# Altium schematic sheet 09_Misc.SchDoc: Misc
size A3; Organization: Lime Microsystems; Address1: Surrey Tech Centre; Address2: Guildford GU2 7YG; Address3: Surrey; Address4: United Kingdom; SheetNumber: 9
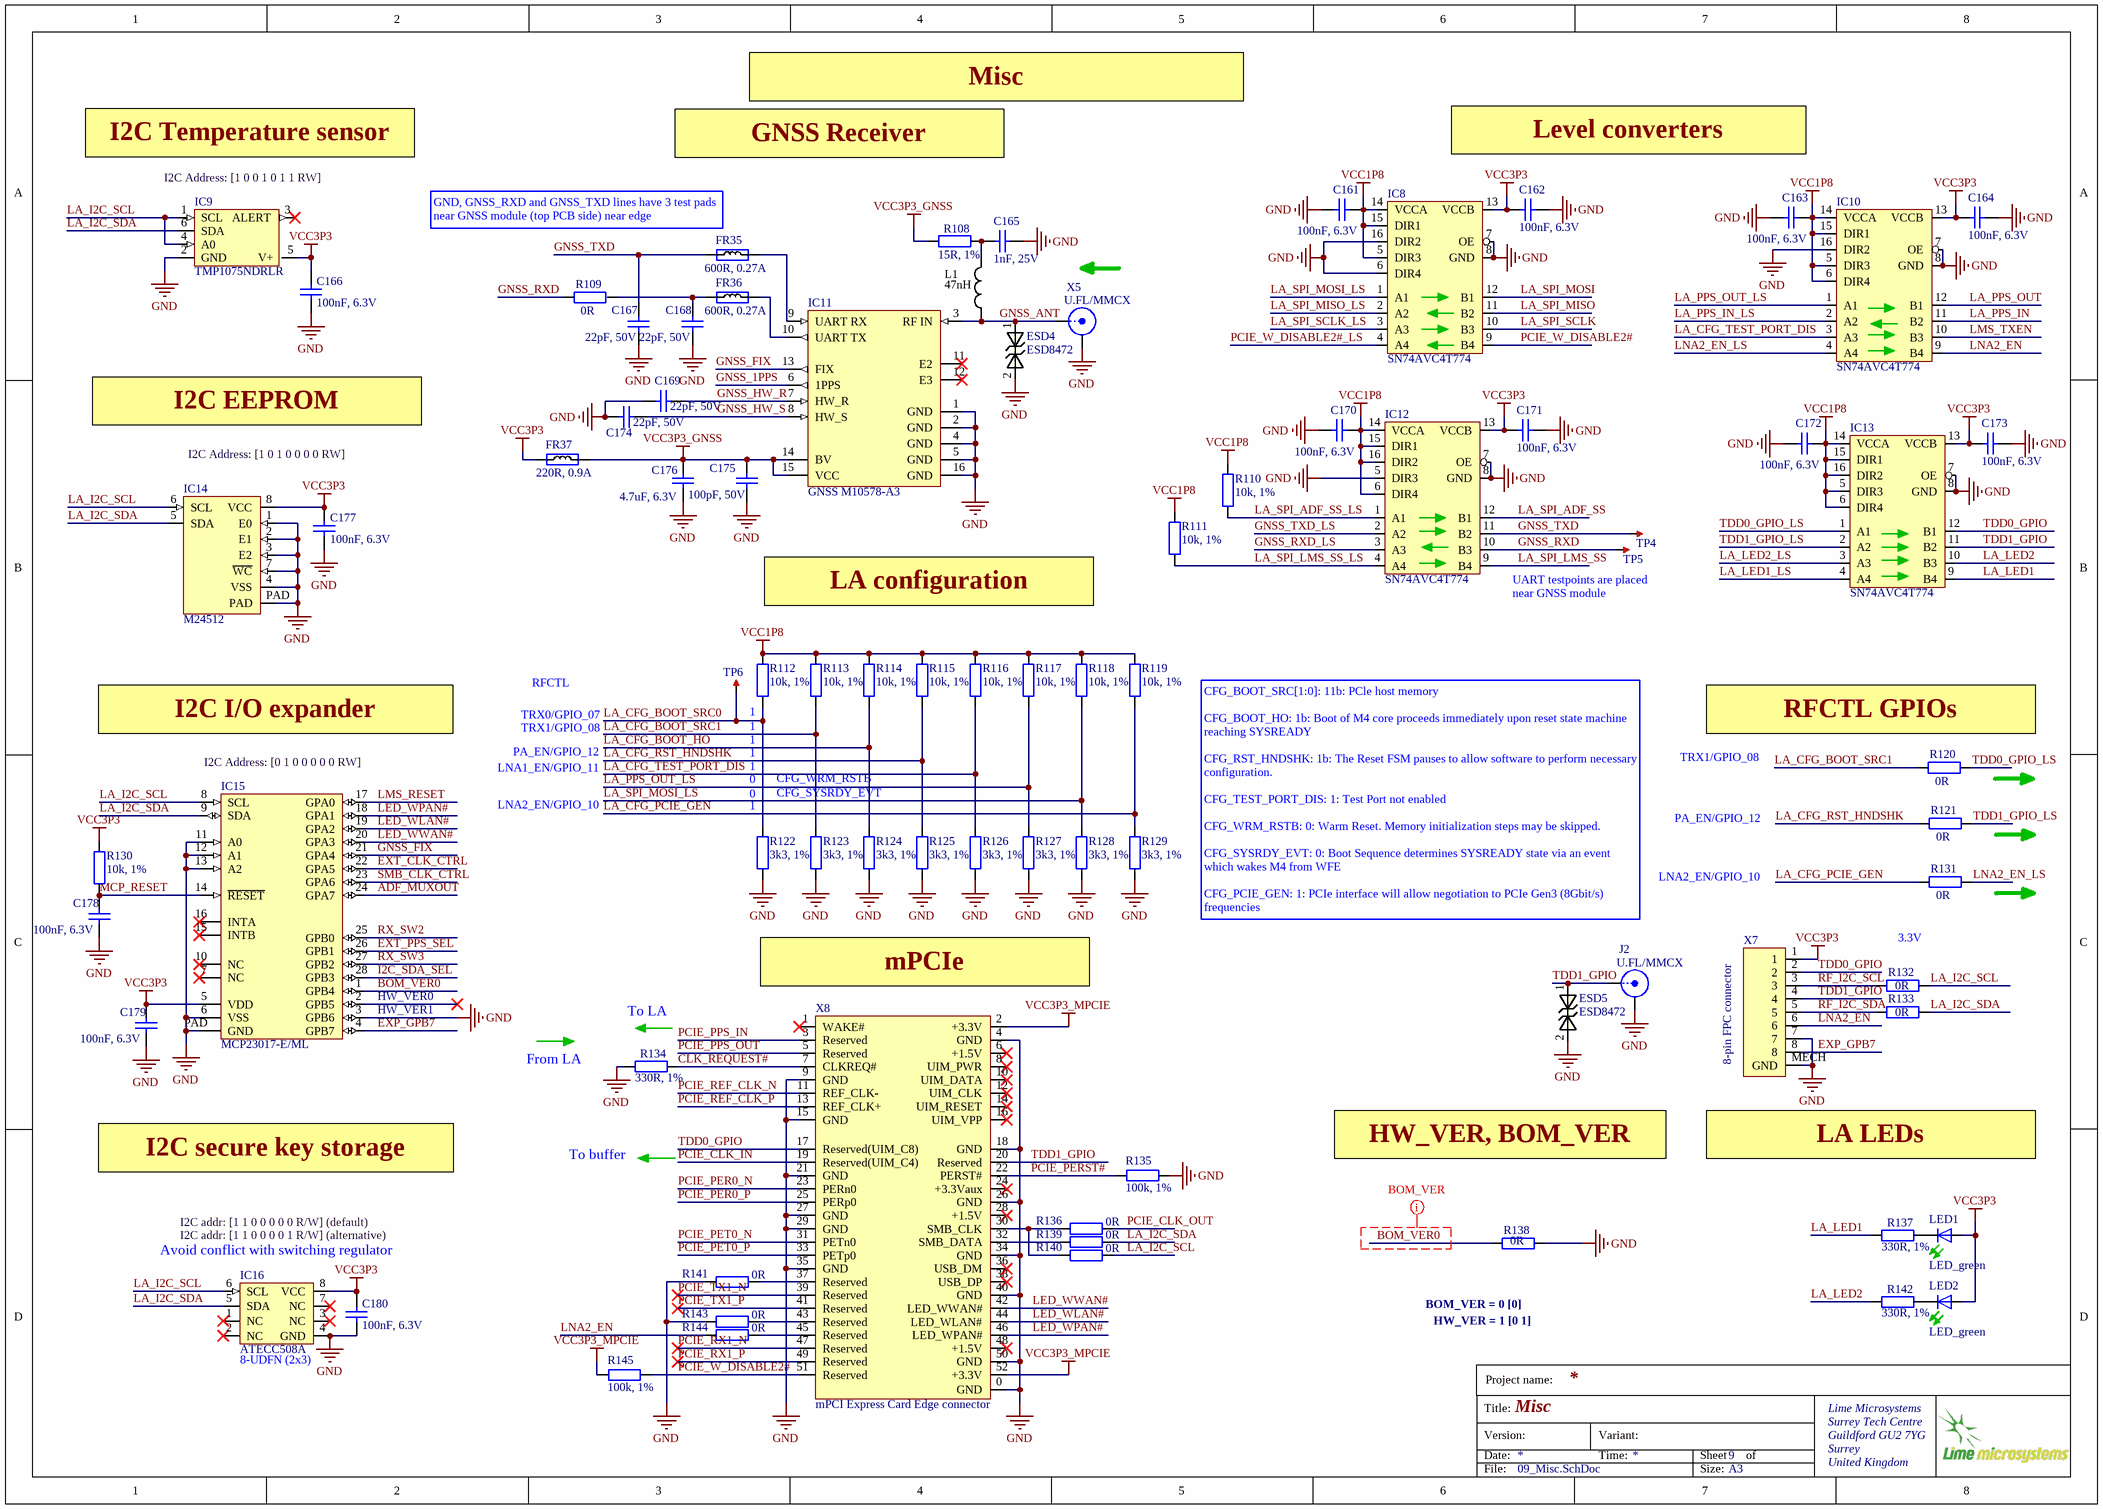
[diagram p0: 09_Misc.SchDoc]

## Parts
C161  100nF, 6.3V  [CAP0201]
C162  100nF, 6.3V  [CAP0201]
C163  100nF, 6.3V  [CAP0201]
C164  100nF, 6.3V  [CAP0201]
C165  1nF, 25V  [CAP0201]
C166  100nF, 6.3V  [CAP0201]
C167  22pF, 50V  [CAP0201]
C168  22pF, 50V  [CAP0201]
C169  22pF, 50V  [CAP0201]
C170  100nF, 6.3V  [CAP0201]
C171  100nF, 6.3V  [CAP0201]
C172  100nF, 6.3V  [CAP0201]
C173  100nF, 6.3V  [CAP0201]
C174  22pF, 50V  [CAP0201]
C175  100pF, 50V  [CAP0201]
C176  4.7uF, 6.3V  [CAP0402]
C177  100nF, 6.3V  [CAP0201]
C178  100nF, 6.3V  [CAP0201]
C179  100nF, 6.3V  [CAP0201]
C180  100nF, 6.3V  [CAP0201]
ESD4  ESD8472  [ESD8472_X3DFN2]
ESD5  ESD8472  [ESD8472_X3DFN2]
FR35  600R, 0.27A  [RES0201]
FR36  600R, 0.27A  [RES0201]
FR37  220R, 0.9A  [RES0402]
IC8  SN74AVC4T774  [SN74AVC4T774_v1]
IC9  TMP1075NDRLR  [TMP1075NDRLR_temperature_sensor_SOT563]
IC10  SN74AVC4T774  [SN74AVC4T774_v1]
IC11  GNSS M10578-A3  [M10578-A3_v2]
IC12  SN74AVC4T774  [SN74AVC4T774_v1]
IC13  SN74AVC4T774  [SN74AVC4T774_v1]
IC14  M24512  [M24128-DFMC6TG]
IC15  MCP23017-E/ML  [MCP23017-E/ML_QFN28]
IC16  ATECC508A  [ATECC508A_UDFN8_v2]
J2  U.FL/MMCX  [MMCX_UFL_conn_u_v2]
L1  47nH  [RES0402]
LED1  LED_green  [LED0201]
LED2  LED_green  [LED0201]
R108  15R, 1%  [RES0201]
R109  0R  [RES0201]
R110  10k, 1%  [RES0201]
R111  10k, 1%  [RES0201]
R112  10k, 1%  [RES0201]
R113  10k, 1%  [RES0201]
R114  10k, 1%  [RES0201]
R115  10k, 1%  [RES0201]
R116  10k, 1%  [RES0201]
R117  10k, 1%  [RES0201]
R118  10k, 1%  [RES0201]
R119  10k, 1%  [RES0201]
R120  0R  [RES0201]
R121  0R  [RES0201]
R122  3k3, 1%  [RES0201]
R123  3k3, 1%  [RES0201]
R124  3k3, 1%  [RES0201]
R125  3k3, 1%  [RES0201]
R126  3k3, 1%  [RES0201]
R127  3k3, 1%  [RES0201]
R128  3k3, 1%  [RES0201]
R129  3k3, 1%  [RES0201]
R130  10k, 1%  [RES0201]
R131  0R  [RES0201]
R132  0R  [RES0201]
R133  0R  [RES0201]
R134  330R, 1%  [RES0201]
R135  100k, 1%  [RES0201]
R136  0R  [RES0201]
R137  330R, 1%  [RES0201]
R138  0R  [RES0201]
R139  0R  [RES0201]
R140  0R  [RES0201]
R141  0R  [RES0201]
R142  330R, 1%  [RES0201]
R143  0R  [RES0201]
R144  0R  [RES0201]
R145  100k, 1%  [RES0201]
TP4  TESTPOINT_PAD  [TP_PAD_1MM]  (value not drawn)  (mechanical)
TP5  TESTPOINT_PAD  [TP_PAD_1MM]  (value not drawn)  (mechanical)
TP6  TESTPOINT_PAD  [TP_PAD_1MM]  (value not drawn)  (no BOM)
X5  U.FL/MMCX  [MMCX_UFL_conn_u_v2]
X7  8-pin FPC connector  [503480-0800_8PIN_FPC_CONN]
X8  mPCI Express Card Edge connector  [PCIe_MiniCard]  (no BOM)

## Nets
GND: C161.1 C162.2 C163.1 C164.2 C165.2 C166.2 C167.2 C168.2 C169.2 C170.1 C171.2 C172.1 C173.2 C174.2 C175.1 C176.1 C177.2 C178.2 C179.2 C180.2 ESD4.2 ESD5.2 IC8.6(DIR4) IC8.7(OE) IC8.8(GND) IC8.16(DIR2) IC9.2(GND) IC10.7(OE) IC10.8(GND) IC10.16(DIR2) IC11.1(GND) IC11.2(GND) IC11.4(GND) IC11.5(GND) IC11.16(GND) IC12.5(DIR3) IC12.7(OE) IC12.8(GND) IC13.7(OE) IC13.8(GND) IC14.1(E0) IC14.2(E1) IC14.3(E2) IC14.4(VSS) IC14.7(~{WC}) IC14.PAD IC15.3(GPB6) IC15.6(VSS) IC15.11(A0) IC15.12(A1) IC15.13(A2) IC15.PAD(GND) IC16.4(GND) J2.2(Y) R122.2 R123.2 R124.2 R125.2 R126.2 R127.2 R128.2 R129.2 R134.2 R135.1 R138.2 R141.1 R143.1 X5.2(Y) X7.7 X7.MECH(GND) X8.0(GND) X8.4(GND) X8.9(GND) X8.15(GND) X8.18(GND) X8.21(GND) X8.26(GND) X8.27(GND) X8.29(GND) X8.34(GND) X8.35(GND) X8.40(GND) X8.50(GND)
VCC1P8: C161.2 C163.2 C170.2 C172.2 IC8.5(DIR3) IC8.14(VCCA) IC8.15(DIR1) IC10.5(DIR3) IC10.6(DIR4) IC10.14(VCCA) IC10.15(DIR1) IC12.6(DIR4) IC12.14(VCCA) IC12.15(DIR1) IC12.16(DIR2) IC13.5(DIR3) IC13.6(DIR4) IC13.14(VCCA) IC13.15(DIR1) IC13.16(DIR2) R110.1 R111.1 R112.1 R113.1 R114.1 R115.1 R116.1 R117.1 R118.1 R119.1
VCC3P3: C162.1 C164.1 C166.1 C171.1 C173.1 C177.1 C179.1 C180.1 FR37.1 IC8.13(VCCB) IC9.5(V+) IC10.13(VCCB) IC12.13(VCCB) IC13.13(VCCB) IC14.8(VCC) IC15.5(VDD) IC16.8(VCC) LED1.A LED2.A R130.1 X7.1
VCC3P3_GNSS: C175.2 C176.2 FR37.2 IC11.14(BV) IC11.15(VCC) R108.2
VCC3P3_MPCIE: R145.2 X8.2(+3.3V) X8.52(+3.3V)
ADF_MUXOUT: IC15.24(GPA7)
BOM_VER0: IC15.1(GPB4) R138.1
CLK_REQUEST#: R134.1 X8.7(CLKREQ#)
EXP_GPB7: IC15.4(GPB7) X7.8
EXT_CLK_CTRL: IC15.22(GPA5)
EXT_PPS_SEL: IC15.26(GPB1)
GNSS_1PPS: IC11.6(1PPS)
GNSS_ANT: ESD4.1 IC11.3(RF_IN) L1.1 X5.1(X)
GNSS_FIX: IC11.13(FIX) IC15.21(GPA4)
GNSS_HW_R: C169.1 IC11.7(HW_R)
GNSS_HW_S: C174.1 IC11.8(HW_S)
GNSS_RXD: IC12.10(B3) R109.1 TP5.1
GNSS_RXD_LS: IC12.3(A3)
GNSS_TXD: C167.1 FR35.1 IC12.11(B2) TP4.1
GNSS_TXD_LS: IC12.2(A2)
I2C_SDA_SEL: IC15.28(GPB3)
LA_CFG_BOOT_HO: R114.2 R124.1
LA_CFG_BOOT_SRC0: R112.2 R122.1 TP6.1
LA_CFG_BOOT_SRC1: R113.2 R120.1 R123.1
LA_CFG_PCIE_GEN: R119.2 R129.1 R131.1
LA_CFG_RST_HNDSHK: R115.2 R121.1 R125.1
LA_CFG_TEST_PORT_DIS: IC10.3(A3) R116.2 R126.1
LA_I2C_SCL: IC9.1(SCL) IC9.4(A0) IC14.6(SCL) IC15.8(SCL) IC16.6(SCL) R132.2 R140.2
LA_I2C_SDA: IC9.6(SDA) IC14.5(SDA) IC15.9(SDA) IC16.5(SDA) R133.2 R139.2
LA_LED1: IC13.9(B4) R137.2
LA_LED1_LS: IC13.4(A4)
LA_LED2: IC13.10(B3) R142.2
LA_LED2_LS: IC13.3(A3)
LA_PPS_IN: IC10.11(B2)
LA_PPS_IN_LS: IC10.2(A2)
LA_PPS_OUT: IC10.12(B1)
LA_PPS_OUT_LS: IC10.1(A1) R117.2 R127.1
LA_SPI_ADF_SS: IC12.12(B1)
LA_SPI_ADF_SS_LS: IC12.1(A1) R110.2
LA_SPI_LMS_SS: IC12.9(B4)
LA_SPI_LMS_SS_LS: IC12.4(A4) R111.2
LA_SPI_MISO: IC8.11(B2)
LA_SPI_MISO_LS: IC8.2(A2)
LA_SPI_MOSI: IC8.12(B1)
LA_SPI_MOSI_LS: IC8.1(A1) R118.2 R128.1
LA_SPI_SCLK: IC8.10(B3)
LA_SPI_SCLK_LS: IC8.3(A3)
LED_WLAN#: IC15.19(GPA2) X8.44(LED_WLAN#)
LED_WPAN#: IC15.18(GPA1) X8.46(LED_WPAN#)
LED_WWAN#: IC15.20(GPA3) X8.42(LED_WWAN#)
LMS_RESET: IC15.17(GPA0)
LMS_TXEN: IC10.10(B3)
LNA2_EN: IC10.9(B4) R144.1 X7.6
LNA2_EN_LS: IC10.4(A4) R131.2
MCP_RESET: C178.1 IC15.14(~{RESET}) R130.2
PCIE_CLK_IN: X8.19(Reserved(UIM_C4))
PCIE_CLK_OUT: R136.2
PCIE_PER0_N: X8.23(PERn0)
PCIE_PER0_P: X8.25(PERp0)
PCIE_PERST#: R135.2 X8.22(PERST#)
PCIE_PET0_N: X8.31(PETn0)
PCIE_PET0_P: X8.33(PETp0)
PCIE_PPS_IN: X8.3(Reserved)
PCIE_PPS_OUT: X8.5(Reserved)
PCIE_REF_CLK_N: X8.11(REF_CLK-)
PCIE_REF_CLK_P: X8.13(REF_CLK+)
PCIE_RX1_N: X8.47(Reserved)
PCIE_RX1_P: X8.49(Reserved)
PCIE_TX1_N: X8.39(Reserved)
PCIE_TX1_P: X8.41(Reserved)
PCIE_W_DISABLE2#: IC8.9(B4) R145.1 X8.51(Reserved)
PCIE_W_DISABLE2#_LS: IC8.4(A4)
RF_I2C_SCL: R132.1 X7.3
RF_I2C_SDA: R133.1 X7.5
RX_SW2: IC15.25(GPB0)
RX_SW3: IC15.27(GPB2)
SMB_CLK_CTRL: IC15.23(GPA6)
TDD0_GPIO: IC13.12(B1) X7.2 X8.17(Reserved(UIM_C8))
TDD0_GPIO_LS: IC13.1(A1) R120.2
TDD1_GPIO: ESD5.1 IC13.11(B2) J2.1(X) X7.4 X8.20(Reserved)
TDD1_GPIO_LS: IC13.2(A2) R121.2
NetC165_1: C165.1 L1.2 R108.1
NetC168_1: C168.1 FR36.1 R109.2
NetFR35_2: FR35.2 IC11.9(UART_RX)
NetFR36_2: FR36.2 IC11.10(UART_TX)
NetLED1_K: LED1.K(C) R137.1
NetLED2_K: LED2.K(C) R142.1
NetR136_1: R136.1 R140.1 X8.30(SMB_CLK)
NetR139_1: R139.1 X8.32(SMB_DATA)
NetR141_2: R141.2 X8.37(Reserved)
NetR143_2: R143.2 X8.43(Reserved)
NetR144_2: R144.2 X8.45(Reserved)

Not connected (* = marked no-connect by the designer): IC9 3(ALERT)*; IC11 11(E2)* 12(E3)*; IC15 2(GPB5)* 7(NC)* 10(NC)* 15(INTB)* 16(INTA)*; IC16 1(NC)* 2(NC)* 3(NC)* 7(NC)*; X8 1(WAKE#)* 6(+1.5V)* 8(UIM_PWR)* 10(UIM_DATA)* 12(UIM_CLK)* 14(UIM_RESET)* 16(UIM_VPP)* 24(+3.3Vaux)* 28(+1.5V)* 36(USB_DM)* 38(USB_DP)* 48(+1.5V)*

## Layout directives
net class BOM_VER: BOM_VER0

## Notes on the sheet
- Misc
- I2C Temperature sensor
- (near IC9) I2C Address: [1 0 0 1 0 1 1 RW]
- GNSS Receiver
- Level converters
- (near FR35) GND, GNSS_RXD and GNSS_TXD lines have 3 test pads near GNSS module (top PCB side) near edge
- I2C EEPROM
- I2C Address: [1 0 1 0 0 0 0 RW]
- LA configuration
- UART testpoints are placed near GNSS module
- TRX0/GPIO_07
- RFCTL
- (near R112) 1
- I2C I/O expander
- (near IC15) I2C Address: [0 1 0 0 0 0 0 RW]
- LNA1_EN/GPIO_11
- PA_EN/GPIO_12
- TRX1/GPIO_08
- 1
- 0
- CFG_WRM_RSTB
- (near R120) RFCTL GPIOs
- LNA2_EN/GPIO_10
- (near R122) 0
- (near R122) 1
- CFG_SYSRDY_EVT
- CFG_BOOT_SRC[1:0]: 11b: PCle host memory
  CFG_BOOT_HO: 1b: Boot of M4 core proceeds immediately upon reset state machine reaching SYSREADY
  CFG_RST_HNDSHK: 1b: The Reset FSM pauses to allow software to perform necessary configuration.
  CFG_TEST_PORT_DIS: 1: Test Port not enabled
  CFG_WRM_RSTB: 0: Warm Reset. Memory initialization steps may be skipped.
  CFG_SYSRDY_EVT: 0: Boot Sequence determines SYSREADY state via an event which wakes M4 from WFE
  CFG_PCIE_GEN: 1: PCIe interface will allow negotiation to PCIe Gen3 (8Gbit/s) frequencies
- (near X8) mPCIe
- 3.3V
- (near IC15) HW_VER0
- (near IC15) HW_VER1
- (near R134) To LA
- From LA
- I2C secure key storage
- To buffer
- HW_VER, BOM_VER
- (near X7) LA LEDs
- Avoid conflict with switching regulator
- I2C addr: [1 1 0 0 0 0 0 R/W] (default)
- I2C addr: [1 1 0 0 0 0 1 R/W] (alternative)
- BOM_VER = 0 [0]
- HW_VER = 1 [0 1]
- (near IC16) 8-UDFN (2x3)
- Project name:
- Title:
- Version:
- Date:
- Variant:
- Time:
- Sheet
- of
- File:
- Size:
- A3

## Library data of the parts
C161-C164 C166 C170-C173 C177-C180 = Cap_0402: Part Description: 0.1 µF ±20% 10V Ceramic Capacitor X5R 0201 (0603 Metric); Manufacturer: Samsung; Manufacturer Part Number 1: CL03A104MP3NNNC; Tolerance: 20%; Voltage Rating (DC): 10V; Value: 100nF, 6.3V; Capacitance: 100nF; Case/Package: 0201; Case Code (Imperial): 0201; Case Code (Metric): 0603; ComponentLink5Description: https://datasheet.ciiva.com/25788/cl03a104mp3nnnc-25788272.pdf?src-supplier=Digi-Key; ComponentLink5URL: https://datasheet.ciiva.com/25788/cl03a104mp3nnnc-25788272.pdf?src-supplier=Digi-Key; Length: 0.024inch; Max Operating Temperature: 85°C; Min Operating Temperature: -55°C; Mount: Surface Mount; Package Quantity: 1; Packaging: Tape and Reel; Pricing 1: 1=0,10000, 10=0,03000, 50=0,01640, 100=0,01330, 500=0,00950, 1000=0,00747, 2500=0,00679, 5000=0,00625 (USD); RoHS: Yes; RoHS Compliant: Yes; Series: CL; Stock 1: 3817176; Supplier 1: Digi-Key; Supplier Part Number 1: 1276-1321-1-ND; Thickness: 0.013inch; Voltage Rating: 10V; Width: 0.012inch
C165 = Cap_0402: Manufacturer Part Number 1: C0603X7R1E102K030BA; Manufacturer: TDK Corporation; Part Description: 1000pF ±10% 25V X7R Ceramic Capacitor -55°C ~ 125°C Surface Mount, MLCC 0201 (0603 Metric) 0.024" L x 0.012" W (0.60mm x 0.30mm); Temperature Coefficient: X7R; Tolerance: ±10%; Capacitance: 1000pF; Value: 1nF, 25V; Supplier 1: Digi-Key; Supplier Part Number 1: 445-7275-1-ND; Voltage - Rated: 25V; Features: -; Package / Case: 0201 (0603 Metric); Lead Spacing: -; Mounting Type: Surface Mount, MLCC; Lead Style: -; Height - Seated (Max): -; Operating Temperature: -55°C ~ 125°C; Size / Dimension: 0.024" L x 0.012" W (0.60mm x 0.30mm); Applications: General Purpose; Ratings: -; Thickness (Max): 0.013" (0.33mm); RoHS: RoHS Compliant; Packaging: Cut Tape (CT); Category: Capacitors
C167-C169 C174 = Cap_0402: Manufacturer: Murata; Manufacturer Part Number 1: GRM0335C1H220JA01D; Part Description: 22 pF ±5% 50V Ceramic Capacitor C0G, NP0 0201 (0603 Metric); Tolerance: 5%; Dielectric: C0G; Value: 22pF, 50V; Supplier 1: Digi-Key; Supplier Part Number 1: 490-6123-1-ND; Stock 1: 2966748; Pricing 1: 1=0,10000, 10=0,01300, 50=0,00720, 100=0,00590, 500=0,00424, 1000=0,00333, 2500=0,00303, 5000=0,00279 (USD); RoHS: Yes; Mount: Surface Mount; Case/Package: 0201; Case Code (Metric): 0603; Case Code (Imperial): 0201; Min Operating Temperature: -55°C; Max Operating Temperature: 125°C; Package Quantity: 15000; Capacitance: 22pF; Voltage Rating: 50V; Packaging: Tape and Reel; Termination: SMD/SMT; Voltage: 50V; Voltage Rating (DC): 50V; Series: GRM; Length: 0.6mm; Width: 0.012inch; Height: 0.3mm; Thickness: 0.013inch; Depth: 0.3mm; Lead Free: Lead Free; RoHS Compliant: Yes; ComponentLink1URL: https://datasheet.ciiva.com/6271/partnumbering-e-01-6271146.pdf?src-supplier=Digi-Key; ComponentLink1Description: https://datasheet.ciiva.com/6271/partnumbering-e-01-6271146.pdf?src-supplier=Digi-Key; ComponentLink2URL: https://datasheet.ciiva.com/6271/partnumbering-e-01-6271143.pdf?src-supplier=Digi-Key; ComponentLink2Description: https://datasheet.ciiva.com/6271/partnumbering-e-01-6271143.pdf?src-supplier=Digi-Key; ComponentLink3URL: https://datasheet.ciiva.com/6271/partnumbering-e-01-6271149.pdf?src-supplier=Digi-Key; ComponentLink3Description: https://datasheet.ciiva.com/6271/partnumbering-e-01-6271149.pdf?src-supplier=Digi-Key
C175 = Cap_0402: Part Description: 100 pF ±5% 50V Ceramic Capacitor C0G, NP0 0201 (0603 Metric); Manufacturer: TDK; Manufacturer Part Number 1: C0603C0G1H101J030BA; Dielectric: C0G; Dielectric Material: Ceramic; Insulation Resistance: 10GR; Tolerance: 5%; Value: 100pF, 50V; Capacitance: 100pF; Case/Package: 0201; Case Code (Imperial): 0201; Case Code (Metric): 0603; ComponentLink1Description: https://datasheet.ciiva.com/24217/c0603c0g1h101j030ba-264106-24217425.pdf?src-supplier=Mouser; ComponentLink1URL: https://datasheet.ciiva.com/24217/c0603c0g1h101j030ba-264106-24217425.pdf?src-supplier=Mouser; ComponentLink2Description: https://datasheet.ciiva.com/16205/mlcc-commercial-general-en-16205590.pdf?src-supplier=Future+Electronics; ComponentLink2URL: https://datasheet.ciiva.com/16205/mlcc-commercial-general-en-16205590.pdf?src-supplier=Future+Electronics; ComponentLink3Description: https://datasheet.ciiva.com/6250/tdkmlcccaprange-6250351.pdf?src-supplier=Digi-Key; ComponentLink3URL: https://datasheet.ciiva.com/6250/tdkmlcccaprange-6250351.pdf?src-supplier=Digi-Key; Construction: Flat; Depth: 0.3mm; Height: 0.3mm; Lead Free: Lead Free; Length: 0.6mm; Max Operating Temperature: 125°C; Min Operating Temperature: -55°C; Mount: Surface Mount; Number of Pins: 2; Package Quantity: 1; Packaging: Tape and Reel; Pricing 1: 1=0,10000, 10=0,06000, 50=0,03280, 100=0,02670, 500=0,01908, 1000=0,01500, 2500=0,01364, 5000=0,01254 (USD); Reach SVHC Compliant: Yes; RoHS: Yes; RoHS Compliant: Yes; Series: C; Stock 1: 367528; Supplier 1: Digi-Key; Supplier Part Number 1: 445-1786-1-ND; Termination: SMD/SMT; Thickness: 0.013inch; Voltage: 50V; Voltage Rating (DC): 50V; Voltage Rating: 50V; Weight: 6E-06oz; Width: 0.012inch
C176 = Cap_0402: Manufacturer: Murata Electronics North America; Manufacturer Part Number 1: GRM155R60J475ME87D; Part Description: 4.7µF ±20% 6.3V X5R Ceramic Capacitor -55°C ~ 85°C Surface Mount, MLCC 0402 (1005 Metric) 0.039" L x 0.020" W (1.00mm x 0.50mm); Tolerance: ±20%; Capacitance: 4.7µF; Temperature Coefficient: X5R; Lead Style: -; Ratings: -; Height - Seated (Max): -; Thickness (Max): 0.022" (0.55mm); Voltage - Rated: 6.3V; Packaging: Cut Tape (CT); Lead Spacing: -; Category: Capacitors; Supplier Part Number 1: 490-5408-1-ND; Applications: General Purpose; Operating Temperature: -55°C ~ 85°C; Mounting Type: Surface Mount, MLCC; Features: Derating Recommended; RoHS: RoHS Compliant; Supplier 1: Digi-Key; Package / Case: 0402 (1005 Metric); Size / Dimension: 0.039" L x 0.020" W (1.00mm x 0.50mm); Value: 4.7uF, 6.3V
ESD4 ESD5 = ESD8472: Manufacturer: ON Semiconductor; Manufacturer Part Number 1: ESD8472MUT5G; Part Description: TVS DIODE 5.3VWM 14VC X3DFN2; Voltage - Reverse Standoff (Typ): 5.3V (Max); Voltage - Breakdown (Min): 7V; Voltage - Clamping (Max) @ Ipp: 14V; Current - Peak Pulse (10/1000µs): 3A (8/20µs); Power Line Protection: No; Capacitance @ Frequency: 0.2pF @ 1MHz; Supplier 1: Digi-Key; RoHS: RoHS Compliant; Category: Circuit Protection; Stock 1: 2295; Pricing 1: 1=0.39, 10=0.315, 100=0.2142, 500=0.16068, 1000=0.12051 (USD); Packaging: Cut Tape (CT); Part Status: Active; Type: Zener; Power - Peak Pulse: -; Applications: Automotive, RF Antenna; Operating Temperature: -55°C ~ 150°C (TJ); Mounting Type: Surface Mount; Package / Case: 2-XFDFN; Supplier Device Package: 2-X3DFN (0.62x0.32); ComponentLink1URL: http://www.onsemi.com/pub/Collateral/ESD8472-D.PDF; ComponentLink1Description: http://www.onsemi.com/pub/Collateral/ESD8472-D.PDF; Supplier Part Number 1: ESD8472MUT5GOSCT-ND
FR35 FR36 = Ferrite: Manufacturer Part Number 1: BK0603TS601-T; Manufacturer: Taiyo Yuden; Part Description: FERRITE BEAD 600 OHM 0201 1LN; DC Resistance (DCR): 750 mOhm Max; Filter Type: Differential Mode - Single; Impedance @ Frequency: 600 Ohm @ 100MHz; Current Rating: 270mA; Value: 600R@100MHz; Supplier 1: Digi-Key; Supplier Part Number 1: 587-3277-1-ND; Size / Dimension: 0.024" L x 0.012" W (0.60mm x 0.30mm); Package / Case: 0201 (0603 Metric); Height (Max): 0.013" (0.33mm); Mounting Type: Surface Mount; Packaging: Cut Tape (CT); RoHS: RoHS Compliant; Category: Filters
FR37 = Ferrite: Manufacturer: TDK Corporation; Manufacturer Part Number 1: MPZ1005S221ET000; Part Description: FERRITE BEAD 220 OHM 0402 1LN; Impedance @ Frequency: 220 Ohm @ 100MHz; Current Rating: 900mA; DC Resistance (DCR): 220 mOhm Max; Supplier 1: Digi-Key; Package / Case: 0402 (1005 Metric); Category: Filters; Supplier Part Number 1: 445-9329-2-ND; Value: 220R, 0.9A
IC8 IC10 IC12 IC13 = SN74AVC4T774: Manufacturer: Texas Instruments; Manufacturer Part Number 1: SN74AVC4T774RSVR; Part Description: Voltage Level Translator Bidirectional 1 Circuit 4 Channel 380Mbps 16-UQFN (2.6x1.8); Logic Function: Translator, Bidirectional, 3-State; Differential - Input:Output: No/No; Propagation Delay (Max): 2.4ns; Number of Bits: 4; Number of Outputs/Channel: 1; Input Type: Logic; Voltage - Supply: 1.2 V ~ 3.6 V; Data Rate: 380Mbps; Supplier 1: Digi-Key; Supplier Device Package: 16-UQFN (2.6x1.8); Packaging: Digi-Reel®; Category: Integrated Circuits (ICs); Mounting Type: Surface Mount; RoHS: RoHS Compliant; Number of Channels: 4; Output Type: Logic; Package / Case: 16-UFQFN; Operating Temperature: -40°C ~ 85°C; Supplier Part Number 1: 296-24741-6-ND
IC9 = TMP1075NDRLR_temperature_sensor: Part Description: Temperature Sensor Digital, Local -40°C ~ 125°C 12 b SOT-563; Manufacturer: Texas Instruments; Supplier 1: Digi-Key; Supplier Part Number 1: 296-TMP1075NDRLRCT-ND; Manufacturer Part Number 1: TMP1075NDRLR; Stock 1: 3405; Pricing 1: 1=0,67000, 5=0,63800, 10=0,55500, 25=0,48760, 50=0,40500, 100=0,34500, 500=0,30000, 1000=0,26250 (USD); RoHS: No; RoHS Compliant: Yes
IC11 = M10578-A3_GPS_GNSS: Manufacturer: Antenova; Part Description: RADIONOVA RF Receiver GPS 1.575GHz -165dBm Module; Frequency: 1.575GHz; Sensitivity: -165dBm; Modulation or Protocol: GPS; Current - Receiving: 28mA; Data Interface: UART; Voltage - Supply: 3.3V; Supplier 1: Digi-Key; Manufacturer Part Number 1: M10578-A3; RoHS: RoHS Compliant; Category: RF/IF and RFID; Stock 1: 0; Pricing 1: 1=17.75, 10=16.061, 25=14.7928, 100=13.5248, 250=12.67952, 500=11.8342 (USD); Packaging: Cut Tape (CT); Part Status: Active; Data Rate (Max): -; Applications: General Purpose; Memory Size: -; Antenna Connector: -; Features: -; Operating Temperature: -40°C ~ 85°C; Package / Case: Module; Supplier Device Package: Module; ComponentLink1URL: http://www.antenova-m2m.com/wp-content/uploads/2015/12/GPS_Radionova_M10578-A3-PS-1.0.pdf; ComponentLink1Description: http://www.antenova-m2m.com/wp-content/uploads/2015/12/GPS_Radionova_M10578-A3-PS-1.0.pdf; Supplier Part Number 1: 627-1074-1-ND
IC14 = M24128-DFMC6TG: Part Description: IC EEPROM 512KBIT I2C 8UFDFPN; Manufacturer: STMicroelectronics; Manufacturer Part Number 1: M24512-DFMC6TG; ComponentLink1URL: http://www.st.com/content/ccc/resource/technical/document/datasheet/59/05/c9/5b/7b/41/48/b6/CD00259167.pdf/files/CD00259167.pdf/jcr:content/translations/en.CD00259167.pdf; ComponentLink1Description: http://www.st.com/content/ccc/resource/technical/document/datasheet/59/05/c9/5b/7b/41/48/b6/CD00259167.pdf/files/CD00259167.pdf/jcr:content/translations/en.CD00259167.pdf; Supplier 1: Digi-Key; Supplier Part Number 1: 497-15745-1-ND; Stock 1: 12789; Pricing 1: 1=1,03, 10=0,935, 25=0,9232, 50=0,9178, 100=0,8206, 250=0,81368, 500=0,80166, 1000=0,77298 (USD); RoHS: Yes; ComponentLink2URL: https://datasheet.ciiva.com/29611/cd00251873-29611552.pdf?src-supplier=Digi-Key; ComponentLink2Description: https://datasheet.ciiva.com/29611/cd00251873-29611552.pdf?src-supplier=Digi-Key
IC15 = MCP23017-E/ML_I2C_expander: Part Description: I/O Expander 16 I²C 1.7 MHz 28-QFN (6x6); Manufacturer: Microchip; ComponentLink1URL: https://datasheet.ciiva.com/1496/12179-1496011.pdf?src-supplier=Element14; ComponentLink1Description: https://datasheet.ciiva.com/1496/12179-1496011.pdf?src-supplier=Element14; ComponentLink2URL: https://datasheet.ciiva.com/1780/21952b-1780121.pdf?src-supplier=Digi-Key; ComponentLink2Description: https://datasheet.ciiva.com/1780/21952b-1780121.pdf?src-supplier=Digi-Key; ComponentLink3URL: https://datasheet.ciiva.com/3149/21952b-3149158.pdf?src-supplier=Avnet; ComponentLink3Description: https://datasheet.ciiva.com/3149/21952b-3149158.pdf?src-supplier=Avnet; ComponentLink4URL: https://datasheet.ciiva.com/16222/filehandler-aspxddocname-en023709-16222331.pdf?src-supplier=Future+Electronics; ComponentLink4Description: https://datasheet.ciiva.com/16222/filehandler-aspxddocname-en023709-16222331.pdf?src-supplier=Future+Electronics; Supplier 1: Digi-Key; Supplier Part Number 1: MCP23017-E/ML-ND; Manufacturer Part Number 1: MCP23017-E/ML; Stock 1: 3965; Pricing 1: 1=1,9, 25=1,59, 100=1,44 (USD); RoHS: Yes
IC16 = ATECC508A_authentication_IC: Manufacturer: Microchip; Manufacturer Part Number 1: ATECC508A-MAHDA-S; Part Description: Authentication Chip IC Networking and Communications 8-UDFN (2x3); Supplier 1: Digi-Key; Stock 1: 27941; Pricing 1: 1=0.73, 25=0.7064 (USD); Supplier Part Number 1: ATECC508A-MAHDA-SDKR-ND
J2 X5 = RF_IF_connector: CONN UMC RCPT STR 50 OHM SMD; Manufacturer: Molex, LLC; Manufacturer Part Number 1: 0734120110; Part Description: Ultra Miniature Coaxial Connector Receptacle, Male Pin 50 Ohm Surface Mount Solder; Body Finish: Nickel; Body Material: Phosphor Bronze; Center Contact Material: Brass; Center Contact Plating: Gold; Connector Style: Ultra Miniature Coaxial; Connector Type: Jack, Male Pin; Contact Termination: Solder; Dielectric Material: Liquid Crystal Polymer (LCP); Frequency - Max: 6GHz; Impedance: 50 Ohm; Voltage Rating: 60V; Cable Group: -; Category: Connectors, Interconnects; Fastening Type: Snap-On; Features: -; Housing Color: Silver; Ingress Protection: -; Mounting Type: Surface Mount; Operating Temperature: -40°C ~ 90°C; Packaging: Cut Tape (CT); RoHS: RoHS Compliant; Shield Termination: Solder; Supplier 1: Digi-Key; Supplier Part Number 1: WM5587CT-ND
L1 = Inductor_0603: Manufacturer: COILCRAFT; Manufacturer Part Number: 0402HP-47NXJLU; Part Description: INDUCTOR, RF, 47NH, 5%, 2.4GHZ, SMD; Product Range:0402HP Series; Inductance:47nH; Inductance Tolerance:± 5%; High Frequency Inductor Case:0402 [1005 Metric]; Self Resonant Frequency Min:2.4GHz; DC Resistance Max:0.58ohm; DC Current Rating:420mA; SVHC: No SVHC (15-Jun-2015); Inductance Tolerance: ± 5%; High Frequency Inductor Case: 0402 [1005 Metric]; Inductance: 47; DC Resistance Max: 0.58; Self Resonant Frequency Min: 2.4; Product Range: 0402; DC Current Rating: 420; Inductor Construction: Wirewound; Supplier 1: Farnell; Supplier Part Number 1: 2285856; Packaging: Cut Tape; Inductor Case Style: 0402 [1005 Metric]; RoHS: Y-EX; value: 47nH; Manufacturer Part Number 1: 0402HP-47NXJLU
LED1 LED2 = LED_green: Part Description: Green 571nm LED Indication - Discrete 1.97V 2-SMD, 0201; Manufacturer: Kingbright; Manufacturer Part Number 1: APG0603CGC-TT; Color: Green; Lens Color: Colorless; Lens Transparency: Clear; Luminous Intensity: 15mcd; Test Current: 10mA; Viewing Angle: 140°; Dominant Wavelength: 571nm; Forward Voltage: 1.97V; ComponentLink1URL: http://www.kingbrightusa.com/images/catalog/SPEC/APG0603CGC-TT.pdf?src-supplier=Digi-Key; ComponentLink1Description: http://www.kingbrightusa.com/images/catalog/SPEC/APG0603CGC-TT.pdf?src-supplier=Digi-Key; Supplier 1: Digi-Key; Supplier Part Number 1: 754-2021-1-ND; Stock 1: 18826; Pricing 1: 1=0,50000, 10=0,30500, 100=0,17530, 1000=0,13720, 2000=0,12577 (USD); RoHS: Yes; Mount: Surface Mount; Case/Package: SMD/SMT; Packaging: Tape and Reel; Length: 0.65mm; Width: 0.35mm; Height: 0.25mm; Lead Free: Lead Free; RoHS Compliant: Yes
R108 = Res_0402: Manufacturer: Yageo; Manufacturer Part Number 1: RC0201FR-0715RL; Part Description: 15 Ohms ±1% 0.05W, 1/20W Chip Resistor 0201 (0603 Metric) Moisture Resistant Thick Film; Power Rating: 50mW; Voltage Rating: 25V; Temperature Coefficient: 200ppm/°C; Value: 15R, 1%; ComponentLink1URL: https://datasheet.ciiva.com/5924/1563626-5924912.pdf?src-supplier=Farnell; ComponentLink1Description: https://datasheet.ciiva.com/5924/1563626-5924912.pdf?src-supplier=Farnell; ComponentLink2URL: https://datasheet.ciiva.com/22661/1563626-22661319.pdf?src-supplier=Element14; ComponentLink2Description: https://datasheet.ciiva.com/22661/1563626-22661319.pdf?src-supplier=Element14; Supplier 1: Digi-Key; Supplier Part Number 1: 311-15.0MCT-ND; Stock 1: 379739; Pricing 1: 1=0,10000, 10=0,03700, 100=0,01530, 1000=0,00685, 2500=0,00595, 5000=0,00491 (USD); RoHS: Yes; Case/Package: 0201; Case Code (Imperial): 0201; Case Code (Metric): 0603; Size Code: 0201; Min Operating Temperature: -55°C; Max Operating Temperature: 125°C; Resistance: 15R; Tolerance: 1%; Packaging: Cut Tape; Package Quantity: 1; Termination: SMD/SMT; Resistor Type: Thick Film; Number of Terminations: 2; Max Power Dissipation: 50mW; Features: Moisture Resistant; Series: RC; Resistance Tolerance: 1%; Length: 0.6mm; Width: 0.3mm; Height: 0.23mm; Lead Free: Lead Free; RoHS Compliant: Yes; ComponentLink3URL: https://datasheet.ciiva.com/7672/1563626-7672202.pdf?src-supplier=Element14; ComponentLink3Description: https://datasheet.ciiva.com/7672/1563626-7672202.pdf?src-supplier=Element14; ComponentLink4URL: https://datasheet.ciiva.com/2493/pyu-r-int-thick-7-2493785.pdf?src-supplier=Digi-Key; ComponentLink4Description: https://datasheet.ciiva.com/2493/pyu-r-int-thick-7-2493785.pdf?src-supplier=Digi-Key; ComponentLink5URL: https://datasheet.ciiva.com/2493/pyu-r-int-thick-7-2493786.pdf?src-supplier=Digi-Key; ComponentLink5Description: https://datasheet.ciiva.com/2493/pyu-r-int-thick-7-2493786.pdf?src-supplier=Digi-Key; ComponentLink6URL: https://datasheet.ciiva.com/2493/pyu-r-int-thick-7-2493784.pdf?src-supplier=Digi-Key; ComponentLink6Description: https://datasheet.ciiva.com/2493/pyu-r-int-thick-7-2493784.pdf?src-supplier=Digi-Key
R109 R120 R121 R131-R133 R136 R138-R141 R143 R144 = Res_0402: Part Description: 0 Ohms Jumper Chip Resistor 0201 (0603 Metric) Moisture Resistant Thick Film; Manufacturer: Yageo; Manufacturer Part Number 1: RC0201JR-070RL; Power Rating: 50mW; Tolerance: 5%; Voltage Rating: 25V; ComponentLink1URL: http://www.yageo.com/documents/recent/PYu-RC_Group_51_RoHS_L_7.pdf; ComponentLink1Description: http://www.yageo.com/documents/recent/PYu-RC_Group_51_RoHS_L_7.pdf; Value: 0R; Supplier 1: Digi-Key; Supplier Part Number 1: 311-0.0NCT-ND; Stock 1: 6252381; Pricing 1: 1=0,10000, 10=0,03700, 25=0,02680, 50=0,02020, 100=0,01500, 250=0,01140, 500=0,00912, 1000=0,00672, 5000=0,00482 (USD); RoHS: Yes; Case/Package: 0201; Case Code (Metric): 0603; Case Code (Imperial): 0201; Weight: 6E-06oz; Contact Plating: Tin,Matte; Size Code: 0201; Min Operating Temperature: -55°C; Max Operating Temperature: 125°C; Packaging: Tape and Reel; Resistance: 0R; Package Quantity: 1; Resistor Type: Thick Film; Number of Terminations: 2; Termination: SMD/SMT; Max Power Dissipation: 50mW; Voltage Rating (DC): 25V; Features: Moisture Resistant; Series: RC; Construction: Rectangular; Resistance Tolerance: 5%; Length: 0.024inch; Width: 0.012inch; Height: 0.01inch; Depth: 0.3mm; Radiation Hardening: No; Military Standard: Not; Lead Free: Lead Free; RoHS Compliant: Yes; ComponentLink2URL: https://datasheet.ciiva.com/7672/1563626-7672248.pdf?src-supplier=Element14; ComponentLink2Description: https://datasheet.ciiva.com/7672/1563626-7672248.pdf?src-supplier=Element14; ComponentLink3URL: https://datasheet.ciiva.com/7672/1563626-7672247.pdf?src-supplier=Element14; ComponentLink3Description: https://datasheet.ciiva.com/7672/1563626-7672247.pdf?src-supplier=Element14; ComponentLink4URL: https://datasheet.ciiva.com/7660/1421516-7660808.pdf?src-supplier=Element14; ComponentLink4Description: https://datasheet.ciiva.com/7660/1421516-7660808.pdf?src-supplier=Element14; ComponentLink5URL: https://datasheet.ciiva.com/46391/1421516-46391340.pdf?src-supplier=Element14; ComponentLink5Description: https://datasheet.ciiva.com/46391/1421516-46391340.pdf?src-supplier=Element14
R110-R119 R130 = Res_0402: Manufacturer: Yageo; Manufacturer Part Number 1: RC0201FR-0710KL; Part Description: 10 kOhms ±1% 0.05W, 1/20W Chip Resistor 0201 (0603 Metric) Moisture Resistant Thick Film; Resistance: 10kR; Power Rating: 50mW; Voltage Rating: 25V; Temperature Coefficient: 200ppm/°C; Value: 10k, 1%; ComponentLink1URL: https://datasheet.ciiva.com/5924/1563626-5924912.pdf?src-supplier=Farnell; ComponentLink1Description: https://datasheet.ciiva.com/5924/1563626-5924912.pdf?src-supplier=Farnell; ComponentLink2URL: https://datasheet.ciiva.com/22661/1563626-22661319.pdf?src-supplier=Element14; ComponentLink2Description: https://datasheet.ciiva.com/22661/1563626-22661319.pdf?src-supplier=Element14; Supplier 1: Digi-Key; Supplier Part Number 1: 311-10.0KMCT-ND; Stock 1: 17142315; Pricing 1: 1=0,10000, 10=0,03700, 100=0,01530, 1000=0,00685, 2500=0,00595, 5000=0,00491 (USD); RoHS: Yes; Case/Package: 0201; Number of Pins: 2; Case Code (Imperial): 0201; Case Code (Metric): 0603; Contact Plating: Tin,Matte; Weight: 6E-06oz; Min Operating Temperature: -55°C; Max Operating Temperature: 125°C; Tolerance: 1%; Packaging: Tape and Reel; Package Quantity: 10000; Termination: SMD/SMT; Resistor Type: Thick Film; Number of Terminations: 2; Max Power Dissipation: 50mW; Voltage Rating (DC): 25V; Features: Moisture Resistant; Series: RC; Resistance Tolerance: 1%; Construction: Rectangular; Working Voltage: 25V; Technology: THICK FILM; Length: 0.6mm; Width: 0.012inch; Height: 0.01inch; Depth: 0.3mm; Radiation Hardening: No; Reach SVHC Compliant: Yes; Military Standard: Not; Lead Free: Lead Free; RoHS Compliant: Yes; ComponentLink3URL: https://datasheet.ciiva.com/7660/1421516-7660807.pdf?src-supplier=Element14; ComponentLink3Description: https://datasheet.ciiva.com/7660/1421516-7660807.pdf?src-supplier=Element14; ComponentLink4URL: https://datasheet.ciiva.com/46391/1421516-46391339.pdf?src-supplier=Element14; ComponentLink4Description: https://datasheet.ciiva.com/46391/1421516-46391339.pdf?src-supplier=Element14; ComponentLink5URL: https://datasheet.ciiva.com/2467/pyu-r-int-thick-7-2467110.pdf?src-supplier=Digi-Key; ComponentLink5Description: https://datasheet.ciiva.com/2467/pyu-r-int-thick-7-2467110.pdf?src-supplier=Digi-Key; ComponentLink6URL: https://datasheet.ciiva.com/2467/pyu-r-int-thick-7-2467111.pdf?src-supplier=Digi-Key; ComponentLink6Description: https://datasheet.ciiva.com/2467/pyu-r-int-thick-7-2467111.pdf?src-supplier=Digi-Key; ComponentLink7URL: https://datasheet.ciiva.com/2467/pyu-r-int-thick-7-2467109.pdf?src-supplier=Digi-Key; ComponentLink7Description: https://datasheet.ciiva.com/2467/pyu-r-int-thick-7-2467109.pdf?src-supplier=Digi-Key
R122-R129 = Res_0402: Manufacturer: Yageo; Manufacturer Part Number 1: RC0201FR-073K3L; Part Description: 3.3 kOhms ±1% 0.05W, 1/20W Chip Resistor 0201 (0603 Metric) Moisture Resistant Thick Film; Max Power Dissipation: 50mW; Resistance: 3.3kR; Temperature Coefficient: 200ppm/°C; Voltage Rating: 25V; ComponentLink1URL: http://www.yageo.com/documents/recent/PYu-RC_Group_51_RoHS_L_7.pdf; ComponentLink1Description: http://www.yageo.com/documents/recent/PYu-RC_Group_51_RoHS_L_7.pdf; ComponentLink2URL: https://datasheet.ciiva.com/22698/1563626-22698524.pdf?src-supplier=Element14; ComponentLink2Description: https://datasheet.ciiva.com/22698/1563626-22698524.pdf?src-supplier=Element14; ComponentLink3URL: https://datasheet.ciiva.com/14985/pyu-r-int-thick-7-14985418.pdf?src-supplier=Digi-Key; ComponentLink3Description: https://datasheet.ciiva.com/14985/pyu-r-int-thick-7-14985418.pdf?src-supplier=Digi-Key; ComponentLink4URL: https://datasheet.ciiva.com/46391/1421516-46391339.pdf?src-supplier=Element14; ComponentLink4Description: https://datasheet.ciiva.com/46391/1421516-46391339.pdf?src-supplier=Element14; ComponentLink5URL: https://datasheet.ciiva.com/2467/pyu-r-int-thick-7-2467110.pdf?src-supplier=Digi-Key; ComponentLink5Description: https://datasheet.ciiva.com/2467/pyu-r-int-thick-7-2467110.pdf?src-supplier=Digi-Key; ComponentLink6URL: https://datasheet.ciiva.com/2467/pyu-r-int-thick-7-2467111.pdf?src-supplier=Digi-Key; ComponentLink6Description: https://datasheet.ciiva.com/2467/pyu-r-int-thick-7-2467111.pdf?src-supplier=Digi-Key; ComponentLink7URL: https://datasheet.ciiva.com/2467/pyu-r-int-thick-7-2467109.pdf?src-supplier=Digi-Key; ComponentLink7Description: https://datasheet.ciiva.com/2467/pyu-r-int-thick-7-2467109.pdf?src-supplier=Digi-Key; Case/Package: 0201; Case Code (Imperial): 0201; Case Code (Metric): 0603; Construction: Rectangular; Depth: 0.3mm; Features: Moisture Resistant; Height: 0.01inch; Length: 0.024inch; Max Operating Temperature: 125°C; Military Standard: Not; Min Operating Temperature: -55°C; Number of Terminations: 2; Package Quantity: 10000; Packaging: Tape and Reel; Power Rating: 50mW; Pricing 1: 1=0,10000, 10=0,03700, 100=0,01500, 1000=0,00672, 2500=0,00583, 5000=0,00482 (USD); Resistance Tolerance: 1%; Resistor Type: Thick Film; RoHS: Yes; RoHS Compliant: Yes; Series: RC; Stock 1: 586100; Supplier 1: Digi-Key; Supplier Part Number 1: YAG2285CT-ND; Termination: SMD/SMT; Tolerance: 1%; Value: 3k3, 1%; Width: 0.3mm
R134 R137 R142 = Res_0402: Part Description: 330 Ohms ±1% 0.05W, 1/20W Chip Resistor 0201 (0603 Metric) Thick Film; Manufacturer: Vishay Dale; Manufacturer Part Number 1: CRCW0201330RFKED; Power Rating: 50mW; Voltage Rating: 30V; Temperature Coefficient: 100ppm/°C; Value: 330R, 1%; Supplier 1: Digi-Key; Supplier Part Number 1: 541-330AABCT-ND; Stock 1: 245078; Pricing 1: 1=0,27000, 10=0,23000, 100=0,08990, 1000=0,03762, 2500=0,03448, 5000=0,03135 (USD); RoHS: Yes; Case/Package: 0201; Weight: 6E-06oz; Case Code (Imperial): 0201; Case Code (Metric): 0603; Contact Plating: Tin; Size Code: 0201; Min Operating Temperature: -55°C; Max Operating Temperature: 155°C; Resistance: 330R; Tolerance: 1%; Packaging: Tape and Reel; Package Quantity: 1; Resistor Type: Thick Film; Number of Terminations: 2; Max Power Dissipation: 50mW; Series: CRCW; Construction: Rectangular; Length: 0.6mm; Width: 0.3mm; Height: 0.011inch; Depth: 0.3mm; Radiation Hardening: No; Military Standard: Not; Lead Free: Lead Free; RoHS Compliant: Yes; ComponentLink1URL: https://datasheet.ciiva.com/8944/crcw0201e3-8944937.pdf?src-supplier=Avnet; ComponentLink1Description: https://datasheet.ciiva.com/8944/crcw0201e3-8944937.pdf?src-supplier=Avnet; ComponentLink2URL: https://datasheet.ciiva.com/2473/crcw0201e3-2473436.pdf?src-supplier=Digi-Key; ComponentLink2Description: https://datasheet.ciiva.com/2473/crcw0201e3-2473436.pdf?src-supplier=Digi-Key; ComponentLink3URL: https://datasheet.ciiva.com/2473/crcw0201e3-2473437.pdf?src-supplier=Digi-Key; ComponentLink3Description: https://datasheet.ciiva.com/2473/crcw0201e3-2473437.pdf?src-supplier=Digi-Key; ComponentLink4URL: https://datasheet.ciiva.com/2473/crcw0201e3-2473438.pdf?src-supplier=Digi-Key; ComponentLink4Description: https://datasheet.ciiva.com/2473/crcw0201e3-2473438.pdf?src-supplier=Digi-Key; ComponentLink5URL: https://datasheet.ciiva.com/16394/dcrcwe3-16394575.pdf?src-supplier=Future+Electronics; ComponentLink5Description: https://datasheet.ciiva.com/16394/dcrcwe3-16394575.pdf?src-supplier=Future+Electronics
R135 R145 = Res_0402: Manufacturer: Yageo; Manufacturer Part Number 1: RC0201FR-07100KL; Part Description: 100 kOhms ±1% 0.05W, 1/20W Chip Resistor 0201 (0603 Metric) Moisture Resistant Thick Film; Resistance: 100kR; Power Rating: 50mW; Voltage Rating: 25V; Temperature Coefficient: 200ppm/°C; Value: 100k, 1%; ComponentLink1URL: https://datasheet.ciiva.com/7672/1563626-7672204.pdf?src-supplier=Element14; ComponentLink1Description: https://datasheet.ciiva.com/7672/1563626-7672204.pdf?src-supplier=Element14; ComponentLink2URL: https://datasheet.ciiva.com/22698/1563626-22698505.pdf?src-supplier=Element14; ComponentLink2Description: https://datasheet.ciiva.com/22698/1563626-22698505.pdf?src-supplier=Element14; ComponentLink3URL: https://datasheet.ciiva.com/29721/pyu-r-int-thick-7-29721196.pdf?src-supplier=Digi-Key; ComponentLink3Description: https://datasheet.ciiva.com/29721/pyu-r-int-thick-7-29721196.pdf?src-supplier=Digi-Key; ComponentLink4URL: https://datasheet.ciiva.com/29721/pyu-r-int-thick-7-29721195.pdf?src-supplier=Digi-Key; ComponentLink4Description: https://datasheet.ciiva.com/29721/pyu-r-int-thick-7-29721195.pdf?src-supplier=Digi-Key; ComponentLink5URL: https://datasheet.ciiva.com/8896/pyu-rc0201-51-rohs-l-8-8896174.pdf?src-supplier=Avnet; ComponentLink5Description: https://datasheet.ciiva.com/8896/pyu-rc0201-51-rohs-l-8-8896174.pdf?src-supplier=Avnet; Supplier 1: Digi-Key; Supplier Part Number 1: 311-100KMCT-ND; Stock 1: 6001055; Pricing 1: 1=0,10000, 10=0,03700, 100=0,01500, 1000=0,00672, 2500=0,00583, 5000=0,00482 (USD); RoHS: Yes; Case/Package: 0201; Number of Pins: 2; Case Code (Imperial): 0201; Case Code (Metric): 0603; Contact Plating: Tin,Matte; Size Code: 0201; Min Operating Temperature: -55°C; Max Operating Temperature: 125°C; Tolerance: 1%; Packaging: Tape and Reel; Package Quantity: 10000; Termination: SMD/SMT; Resistor Type: Thick Film; Number of Terminations: 2; Max Power Dissipation: 50mW; Voltage Rating (DC): 25V; Features: Moisture Resistant; Series: RC; Resistance Tolerance: 1%; Construction: Rectangular; Length: 0.024inch; Width: 0.012inch; Height: 0.01inch; Depth: 0.3mm; Reach SVHC Compliant: Yes; Military Standard: Not; Lead Free: Lead Free; RoHS Compliant: Yes; ComponentLink6URL: https://datasheet.ciiva.com/7660/1421516-7660806.pdf?src-supplier=Element14; ComponentLink6Description: https://datasheet.ciiva.com/7660/1421516-7660806.pdf?src-supplier=Element14; ComponentLink7URL: https://datasheet.ciiva.com/22698/1563626-22698495.pdf?src-supplier=Element14; ComponentLink7Description: https://datasheet.ciiva.com/22698/1563626-22698495.pdf?src-supplier=Element14; ComponentLink8URL: https://datasheet.ciiva.com/46391/1421516-46391338.pdf?src-supplier=Element14; ComponentLink8Description: https://datasheet.ciiva.com/46391/1421516-46391338.pdf?src-supplier=Element14; ComponentLink9URL: https://datasheet.ciiva.com/2493/pyu-r-int-thick-7-2493770.pdf?src-supplier=Digi-Key; ComponentLink9Description: https://datasheet.ciiva.com/2493/pyu-r-int-thick-7-2493770.pdf?src-supplier=Digi-Key; ComponentLink10URL: https://datasheet.ciiva.com/2493/pyu-r-int-thick-7-2493771.pdf?src-supplier=Digi-Key; ComponentLink10Description: https://datasheet.ciiva.com/2493/pyu-r-int-thick-7-2493771.pdf?src-supplier=Digi-Key; ComponentLink11URL: https://datasheet.ciiva.com/2493/pyu-r-int-thick-7-2493769.pdf?src-supplier=Digi-Key; ComponentLink11Description: https://datasheet.ciiva.com/2493/pyu-r-int-thick-7-2493769.pdf?src-supplier=Digi-Key; ComponentLink12URL: https://datasheet.ciiva.com/26829/getdatasheetpartid-420441-26829850.pdf?src-supplier=Verical; ComponentLink12Description: https://datasheet.ciiva.com/26829/getdatasheetpartid-420441-26829850.pdf?src-supplier=Verical
TP4-TP6 = TESTPOINT_PAD: Test Point PCB mount Miniature White
X7 = 503480-0800_8PIN_FPC_CONN: Part Description: 8 Position FFC, FPC Connector Contacts, Top and Bottom 0.020" (0.50mm) Surface Mount, Right Angle; Manufacturer: Molex; Supplier 1: Digi-Key; Supplier Part Number 1: WM1388CT-ND; Manufacturer Part Number 1: 503480-0800; Stock 1: 119007; Pricing 1: 1=0,92000, 10=0,76100, 100=0,63420, 1000=0,50736 (USD); RoHS: Yes; ComponentLink1URL: https://datasheet.ciiva.com/671/5034800400-sd-671136.pdf?src-supplier=Digi-Key; ComponentLink1Description: https://datasheet.ciiva.com/671/5034800400-sd-671136.pdf?src-supplier=Digi-Key; ComponentLink2URL: https://datasheet.ciiva.com/5751/1631789-5751170.pdf?src-supplier=Farnell; ComponentLink2Description: https://datasheet.ciiva.com/5751/1631789-5751170.pdf?src-supplier=Farnell; ComponentLink3URL: https://datasheet.ciiva.com/10363/5034800800-ffc-fpc-connectors-10363985.pdf?src-supplier=Avnet; ComponentLink3Description: https://datasheet.ciiva.com/10363/5034800800-ffc-fpc-connectors-10363985.pdf?src-supplier=Avnet; ComponentLink4URL: https://datasheet.ciiva.com/5138/5034800800-ffc-fpc-connectors-179547-5138276.pdf?src-supplier=Mouser; ComponentLink4Description: https://datasheet.ciiva.com/5138/5034800800-ffc-fpc-connectors-179547-5138276.pdf?src-supplier=Mouser; ComponentLink5URL: https://datasheet.ciiva.com/26825/getdatasheetpartid-495673-26825585.pdf?src-supplier=Verical; ComponentLink5Description: https://datasheet.ciiva.com/26825/getdatasheetpartid-495673-26825585.pdf?src-supplier=Verical
X8 = PCIe_MiniCard_fingers: PCIe MiniCard full or half size